# EasyEDA schematic TempDataLogger.json

## Sheets
1 Main circuit: TITLE: Main circuit; REV: 1.0; Date: 2024-03-28; Sheet: 1/1; Drawn By: Gustavo N. Santiago; Company: Ciampitti Lab
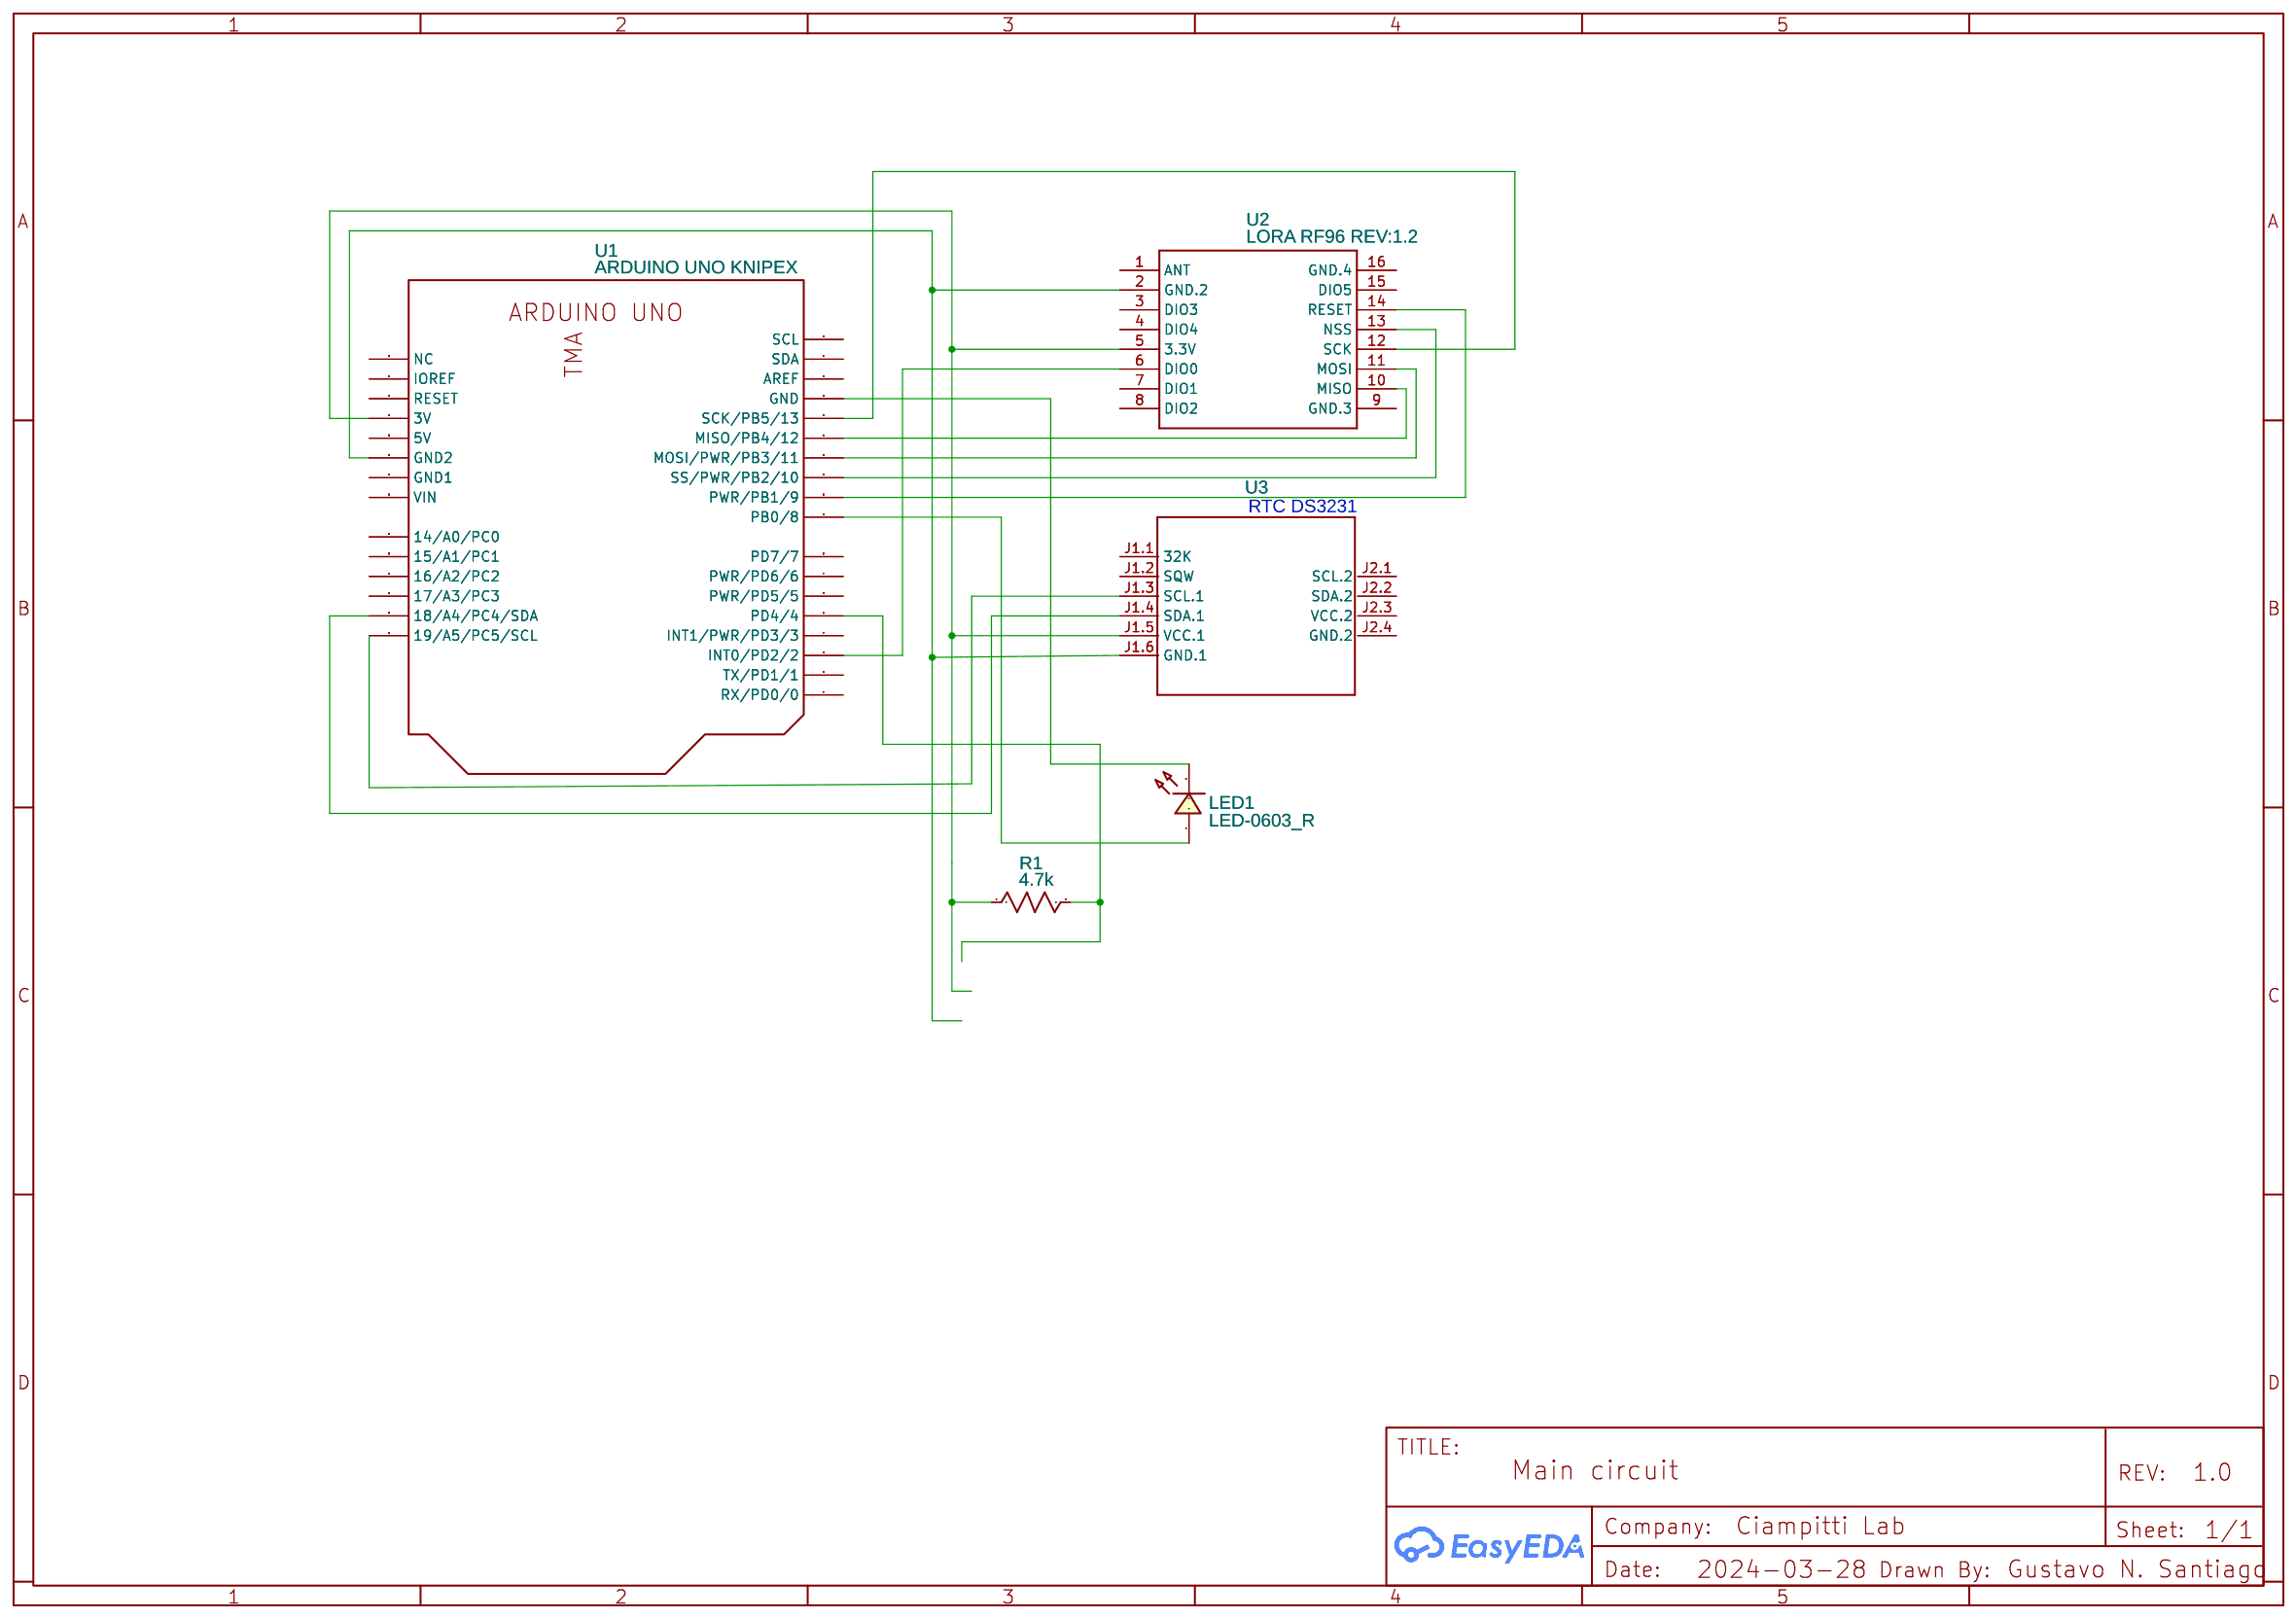
[diagram p0: Main circuit]
2 Sensors: TITLE: Sensors
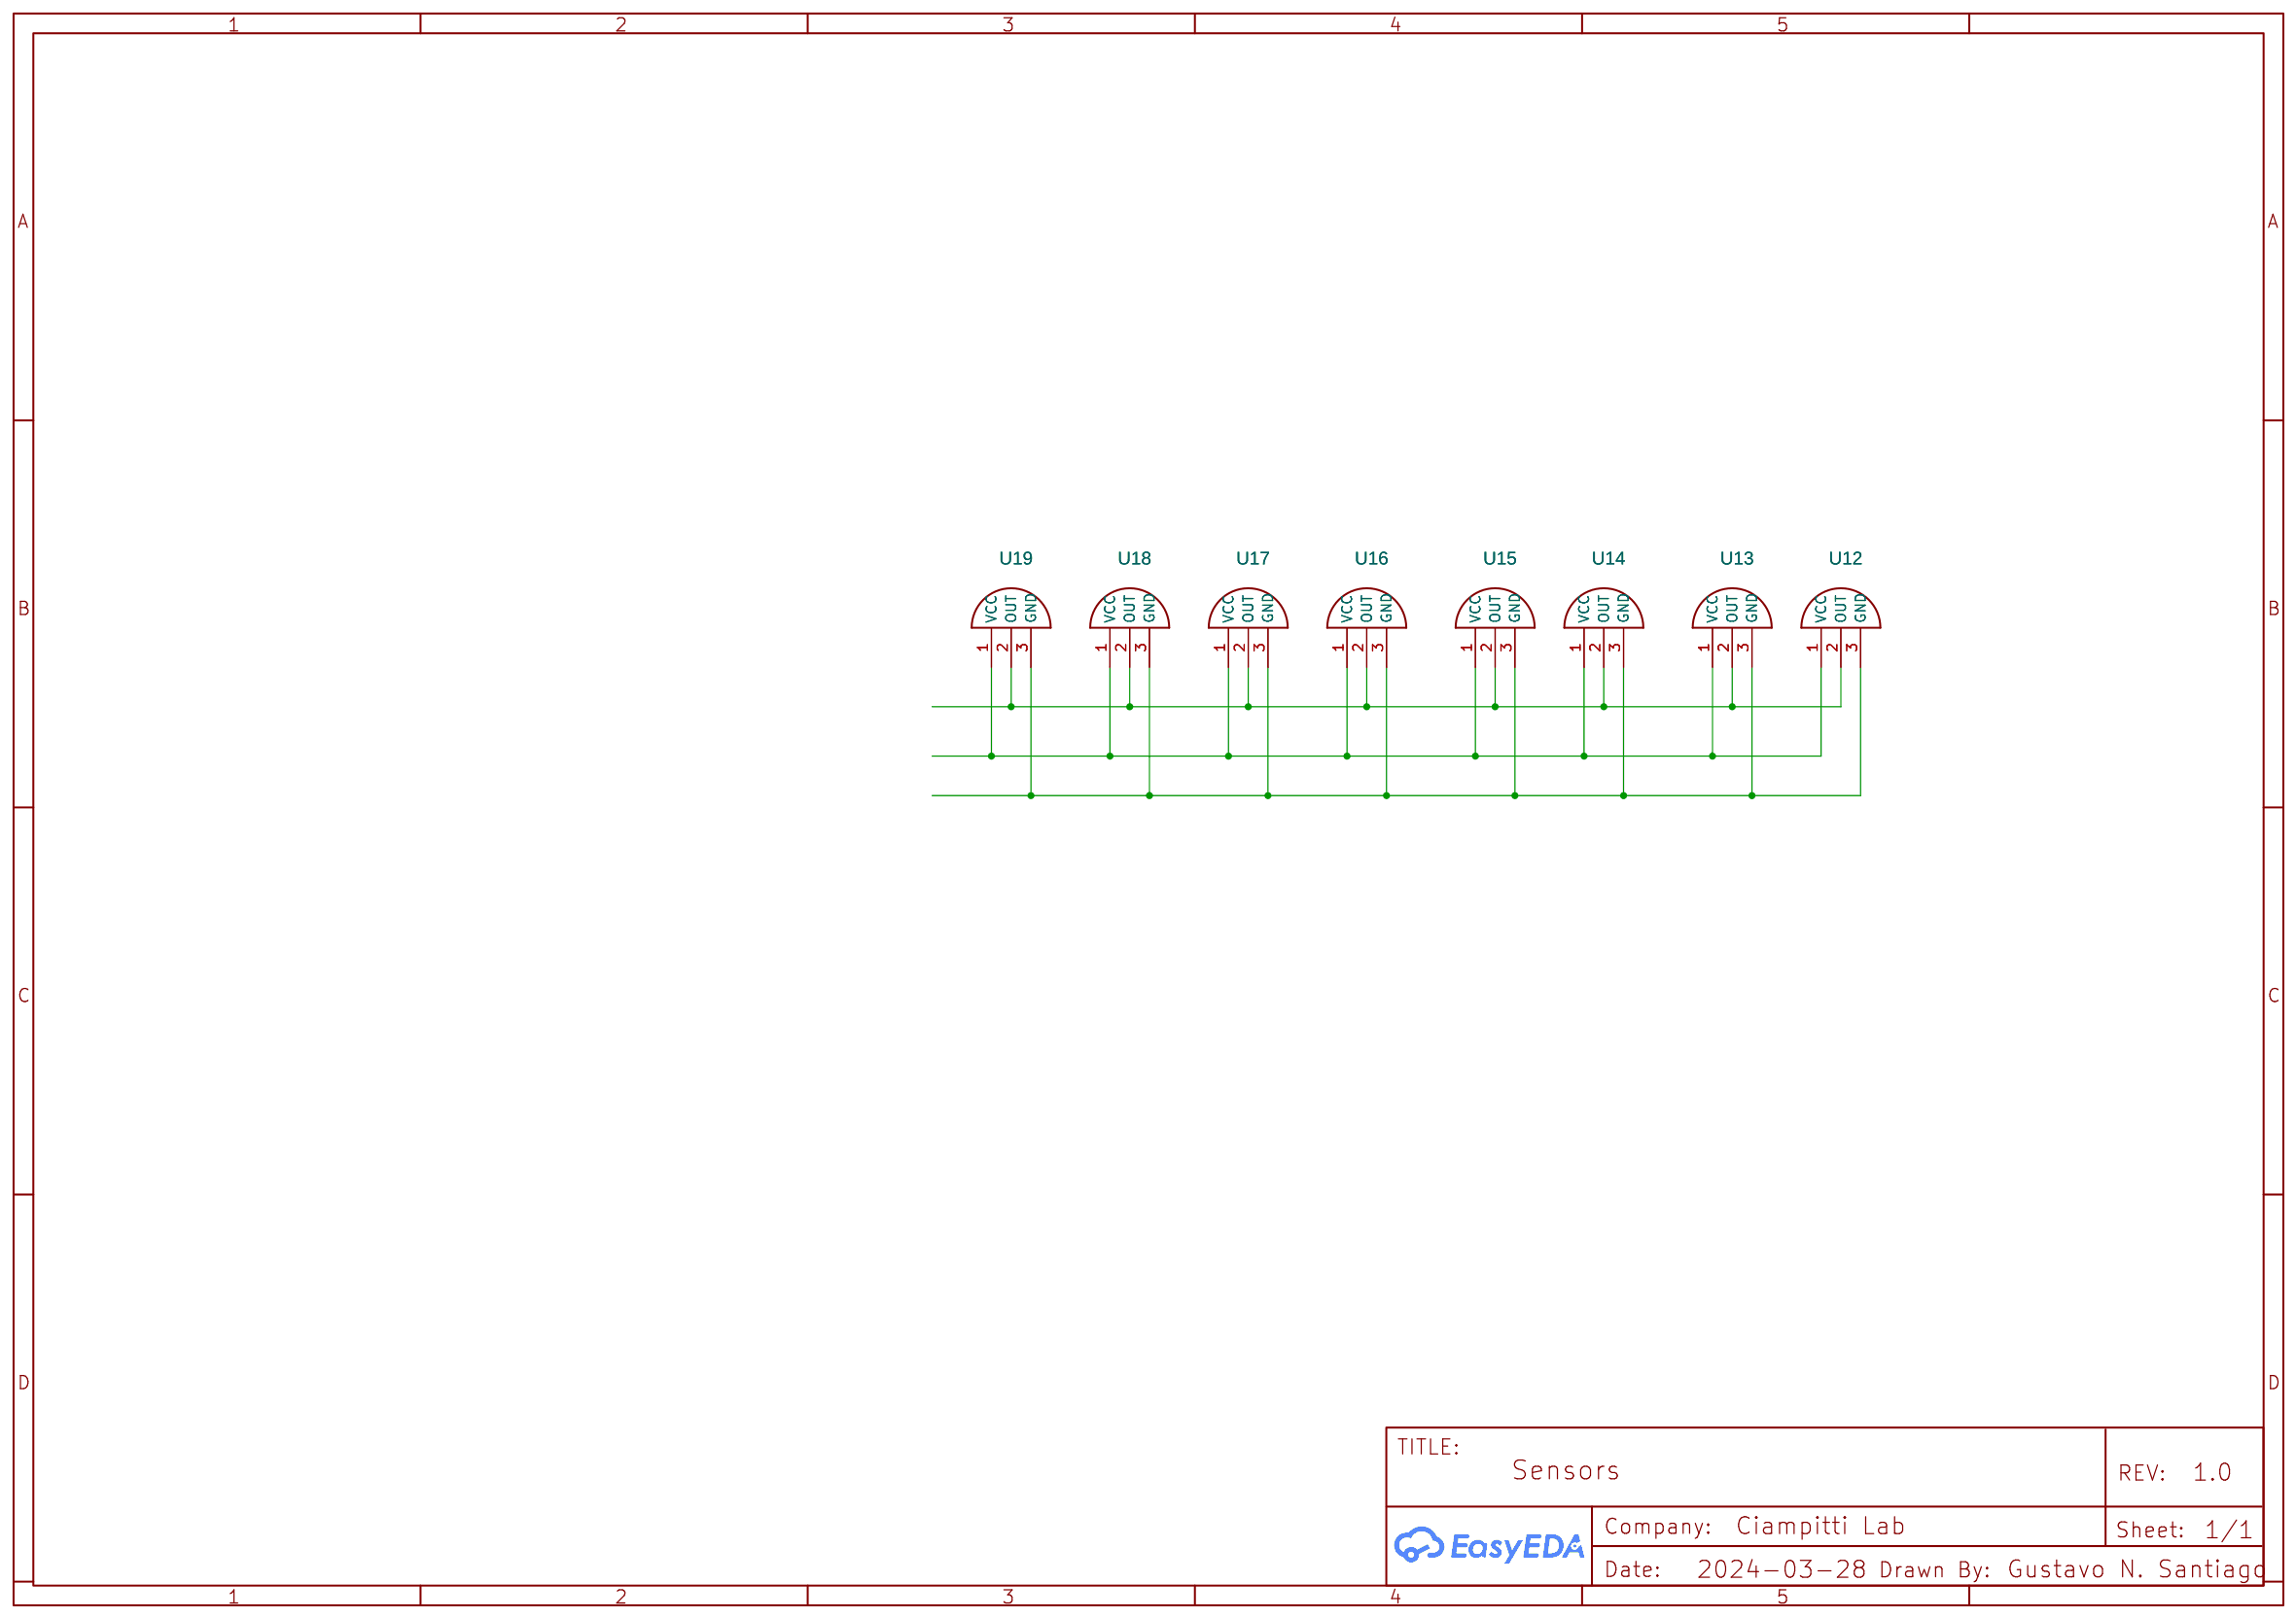
[diagram p1: Sensors]

## Parts
sheet Main circuit
LED1  LED-0603_R  [LED0603_RED]
R1  4.7k  [R0603]
U1  ARDUINO UNO KNIPEX  [UNO_R3;WO ARDUINO UNO]
U2  LORA RF96 REV:1.2  [LORA RF96 REV:1.2]
U3  NO  [RTC-DS3231-AT24C32]
sheet Sensors
U12  NO  [DS18B20]
U13  NO  [DS18B20]
U14  NO  [DS18B20]
U15  NO  [DS18B20]
U16  NO  [DS18B20]
U17  NO  [DS18B20]
U18  NO  [DS18B20]
U19  NO  [DS18B20]

## Library data of the parts
LED1 = LED-0603_R: Manufacturer: EVERLIGHT(台湾亿光); Manufacturer Part: 19-217/R6C-AL1M2VY/3T; Supplier Part: C72044; Supplier: LCSC; Contributor: LCEDA_01
R1 = R_0603_US: Contributor: LCEDA_Lib
U1 = ARDUINO UNO KNIPEX: Contributor: knipex; sourceId: frlCUcuMG
U2 = LORA RF96 REV:1.2
U3 = RTC-DS3231-AT24C32: Contributor: Koushik1111
U12-U19 = DS18B20 TEMPERATURE: Manufacturer Part: New SchematicLib; Contributor: felixzhdanov

## Nets
Net-(LED1-1): LED1.1 U1.9(PB0/8)
Net-(LED1-2): LED1.2 U1.15(GND)
Net-(R1-1): R1.1 U1.29(3V) U2.5(3.3V) U3.J1.5(VCC.1)
Net-(R1-2): R1.2 U1.5(PD4/4)
Net-(U1-3): U1.3(INT0/PD2/2) U2.6(DIO0)
Net-(U1-10): U1.10(PWR/PB1/9) U2.14(RESET)
Net-(U1-11): U1.11(SS/PWR/PB2/10) U2.13(NSS)
Net-(U1-12): U1.12(MOSI/PWR/PB3/11) U2.11(MOSI)
Net-(U1-13): U1.13(MISO/PB4/12) U2.10(MISO)
Net-(U1-14): U1.14(SCK/PB5/13) U2.12(SCK)
Net-(U1-19): U1.19(19/A5/PC5/SCL) U3.J1.3(SCL.1)
Net-(U1-20): U1.20(18/A4/PC4/SDA) U3.J1.4(SDA.1)
Net-(U1-27): U1.27(GND2) U2.2(GND.2) U3.J1.6(GND.1)
Net-(U12-1): U12.1(VCC) U13.1(VCC) U14.1(VCC) U15.1(VCC) U16.1(VCC) U17.1(VCC) U18.1(VCC) U19.1(VCC)
Net-(U12-2): U12.2(OUT) U13.2(OUT) U14.2(OUT) U15.2(OUT) U16.2(OUT) U17.2(OUT) U18.2(OUT) U19.2(OUT)
Net-(U12-3): U12.3(GND) U13.3(GND) U14.3(GND) U15.3(GND) U16.3(GND) U17.3(GND) U18.3(GND) U19.3(GND)

Not connected (* = marked no-connect by the designer): U1 1(RX/PD0/0) 2(TX/PD1/1) 4(INT1/PWR/PD3/3) 6(PWR/PD5/5) 7(PWR/PD6/6) 8(PD7/7) 16(AREF) 17(SDA) 18(SCL) 21(17/A3/PC3) 22(16/A2/PC2) 23(15/A1/PC1) 24(14/A0/PC0) 25(VIN) 26(GND1) 28(5V) 30(RESET) 31(IOREF) 32(NC); U2 1(ANT) 3(DIO3) 4(DIO4) 7(DIO1) 8(DIO2) 9(GND.3) 15(DIO5) 16(GND.4); U3 J1.1(32K) J1.2(SQW) J2.1(SCL.2) J2.2(SDA.2) J2.3(VCC.2) J2.4(GND.2)

## Notes on the sheets
sheet 1
- RTC DS3231
